# EAGLE schematic BatteryTestBoard V1 (EAGLE 8.2.2)
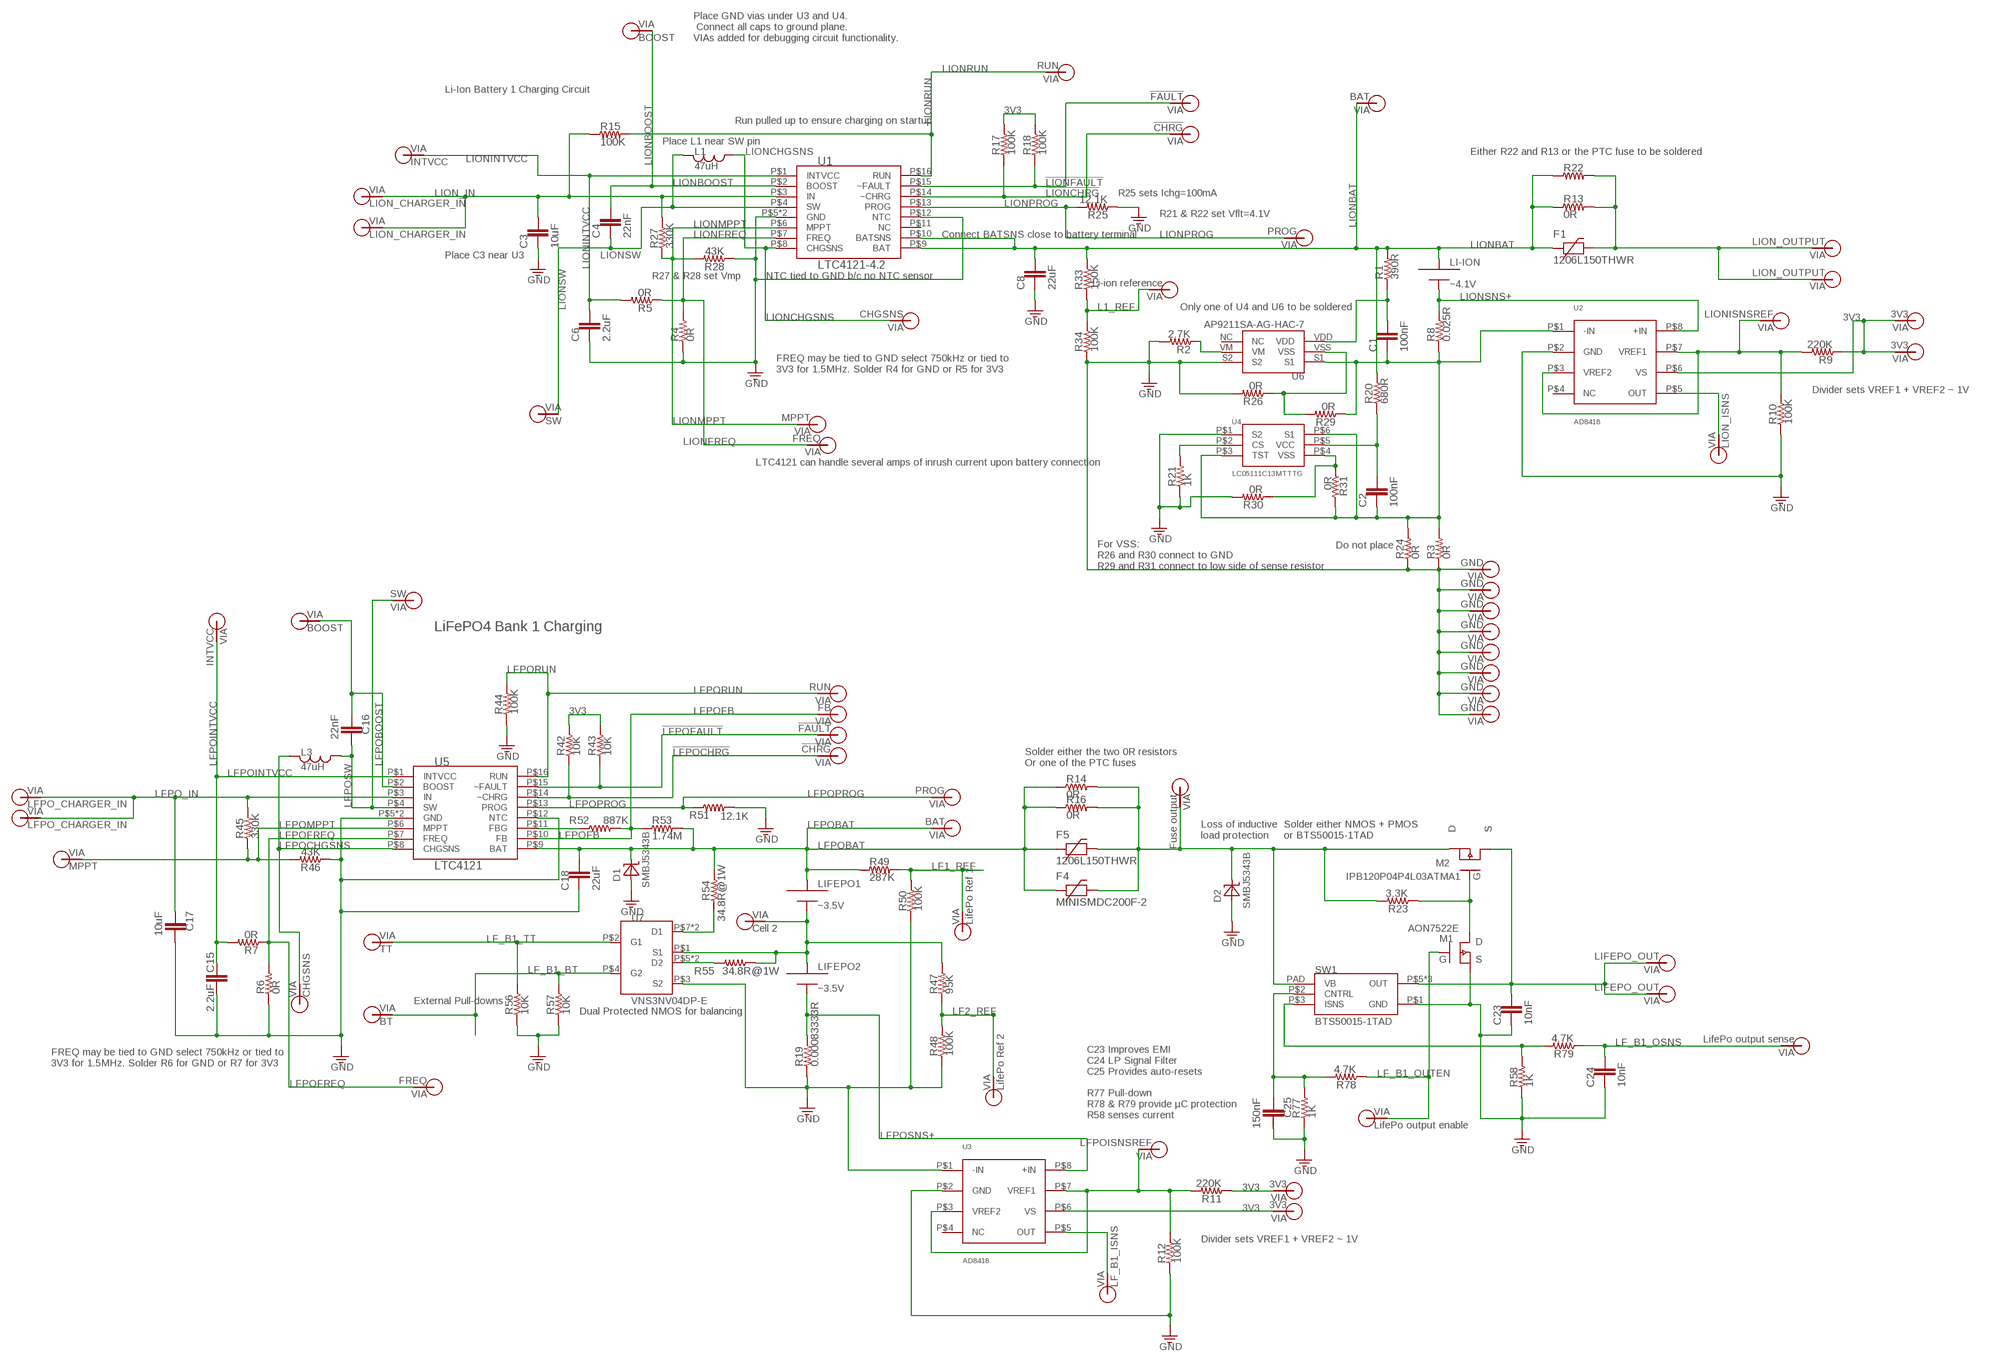
[diagram p0: schematic, sheet 1]

## Parts
C1  100nF  CAP0805  [0805]
C2  100nF  CAP0805  [0805]
C3  10uF  CAP0805  [0805]
C4  22nF  CAP0805  [0805]
C6  2.2uF  CAP0805  [0805]
C8  22uF  CAP0805  [0805]
C15  2.2uF  CAP0805  [0805]
C16  22nF  CAP0805  [0805]
C17  10uF  CAP0805  [0805]
C18  22uF  CAP0805  [0805]
C23  10nF  CAP0805  [0805]
C24  10nF  CAP0805  [0805]
C25  150nF  CAP0805  [0805]
D1  SMBJ5343B  [DO214AA]
D2  SMBJ5343B  [DO214AA]
F1  1206L150THWR  [1206]
F4  MINISMDC200F-2  [1812]
F5  1206L150THWR  [1206]
L1  47uH  IND1812  [1812]
L3  47uH  IND1812  [1812]
LI-ION  ~4.1V  LI-ION  [EQUISAT-BATTERY-VA]
LIFEPO1  ~3.5V  LIFEPO4VA  [EQUISAT-BATTERY-VA]
LIFEPO2  ~3.5V  LIFEPO4VA  [EQUISAT-BATTERY-VA]
M1  AON7522E  [DFN-3X3-8]
M2  IPB120P04P4L03ATMA1  [TO263]
R1  390R  RES0805  [0805]
R2  2.7K  RES0805  [0805]
R3  0R  RES1210  [1210]
R4  0R  RES0805  [0805]
R5  0R  RES0805  [0805]
R6  0R  RES0805  [0805]
R7  0R  RES0805  [0805]
R8  0.025R  RES1210  [1210]
R9  220K  RES0805  [0805]
R10  100K  RES0805  [0805]
R11  220K  RES0805  [0805]
R12  100K  RES0805  [0805]
R13  0R  RES1210  [1210]
R14  0R  RES1210  [1210]
R15  100K  RES0805  [0805]
R16  0R  RES1210  [1210]
R17  100K  RES0805  [0805]
R18  100K  RES0805  [0805]
R19  0.00083333R  RES1210  [1210]
R20  680R  RES0805  [0805]
R21  1K  RES0805  [0805]
R22  0R  RES1210  [1210]
R23  3.3K  RES0805  [0805]
R24  0R  RES1210  [1210]
R25  12.1K  RES0805  [0805]
R26  0R  RES0805  [0805]
R27  330K  RES0805  [0805]
R28  43K  RES0805  [0805]
R29  0R  RES0805  [0805]
R30  0R  RES0805  [0805]
R31  0R  RES0805  [0805]
R33  150K  RES0805  [0805]
R34  100K  RES0805  [0805]
R42  10K  RES0805  [0805]
R43  10K  RES0805  [0805]
R44  100K  RES0805  [0805]
R45  330K  RES0805  [0805]
R46  43K  RES0805  [0805]
R47  95K  RES0805  [0805]
R48  100K  RES0805  [0805]
R49  287K  RES0805  [0805]
R50  100K  RES0805  [0805]
R51  12.1K  RES0805  [0805]
R52  887K  RES0805  [0805]
R53  1.74M  RES0805  [0805]
R54  34.8R@1W  RES1210  [1210]
R55  34.8R@1W  RES1210  [1210]
R56  10K  RES0805  [0805]
R57  10K  RES0805  [0805]
R58  1K  RES0805  [0805]
R77  1K  RES0805  [0805]
R78  4.7K  RES0805  [0805]
R79  4.7K  RES0805  [0805]
SW1  BTS50015-1TAD  [TO-263-7-8]
U1  LTC4121-4.2  [QFN-16-PAD]
U2  AD8418  [MSOP-8]
U3  AD8418  [MSOP-8]
U4  LC05111C13MTTTG  [WDFN6]
U5  LTC4121  [QFN-16-PAD]
U6  AP9211SA-AG-HAC-7  [U-DFN2030-6]
U7  VNS3NV04DP-E  [SO-8]
V1  LION_OUTPUT  VIA-120MIL  [VIA-120MIL]
V2  Fuse output  VIA60MIL-SQ  [VIA-60MIL-SQ]
V3  GND  VIA60MIL-SQ  [VIA-60MIL-SQ]
V4  GND  VIA60MIL-SQ  [VIA-60MIL-SQ]
V5  GND  VIA60MIL-SQ  [VIA-60MIL-SQ]
V6  GND  VIA60MIL-SQ  [VIA-60MIL-SQ]
V7  GND  VIA60MIL-SQ  [VIA-60MIL-SQ]
V8  GND  VIA60MIL-SQ  [VIA-60MIL-SQ]
V9  LFPO_CHARGER_IN  VIA60MIL-SQ  [VIA-60MIL-SQ]
V10  GND  VIA60MIL-SQ  [VIA-60MIL-SQ]
V11  LFPOISNSREF  VIA60MIL-SQ  [VIA-60MIL-SQ]
V12  LIONISNSREF  VIA60MIL-SQ  [VIA-60MIL-SQ]
V13  LF_B1_ISNS  VIA60MIL-SQ  [VIA-60MIL-SQ]
V16  Cell 2  VIA60MIL-SQ  [VIA-60MIL-SQ]
V20  LifePo output enable  VIA60MIL-SQ  [VIA-60MIL-SQ]
V21  LIFEPO_OUT  VIA-120MIL  [VIA-120MIL]
V26  LIFEPO_OUT  VIA-120MIL  [VIA-120MIL]
V29  TT  VIA60MIL-SQ  [VIA-60MIL-SQ]
V31  LifePo output sense  VIA60MIL-SQ  [VIA-60MIL-SQ]
V32  BT  VIA60MIL-SQ  [VIA-60MIL-SQ]
V34  LION_CHARGER_IN  VIA60MIL-SQ  [VIA-60MIL-SQ]
V35  LION_CHARGER_IN  VIA60MIL-SQ  [VIA-60MIL-SQ]
V36  BOOST  VIA60MIL-SQ  [VIA-60MIL-SQ]
V37  LION_OUTPUT  VIA-120MIL  [VIA-120MIL]
V38  SW  VIA60MIL-SQ  [VIA-60MIL-SQ]
V39  MPPT  VIA60MIL-SQ  [VIA-60MIL-SQ]
V41  GND  VIA60MIL-SQ  [VIA-60MIL-SQ]
V43  LION_ISNS  VIA60MIL-SQ  [VIA-60MIL-SQ]
V44  Li-ion reference  VIA60MIL-SQ  [VIA-60MIL-SQ]
V46  CHGSNS  VIA60MIL-SQ  [VIA-60MIL-SQ]
V47  FREQ  VIA60MIL-SQ  [VIA-60MIL-SQ]
V48  BAT  VIA60MIL-SQ  [VIA-60MIL-SQ]
V50  PROG  VIA60MIL-SQ  [VIA-60MIL-SQ]
V51  !CHRG  VIA60MIL-SQ  [VIA-60MIL-SQ]
V52  !FAULT  VIA60MIL-SQ  [VIA-60MIL-SQ]
V53  RUN  VIA60MIL-SQ  [VIA-60MIL-SQ]
V54  BOOST  VIA60MIL-SQ  [VIA-60MIL-SQ]
V55  INTVCC  VIA60MIL-SQ  [VIA-60MIL-SQ]
V57  SW  VIA60MIL-SQ  [VIA-60MIL-SQ]
V58  LifePo Ref 1  VIA60MIL-SQ  [VIA-60MIL-SQ]
V59  LifePo Ref 2  VIA60MIL-SQ  [VIA-60MIL-SQ]
V60  MPPT  VIA60MIL-SQ  [VIA-60MIL-SQ]
V61  CHGSNS  VIA60MIL-SQ  [VIA-60MIL-SQ]
V62  FREQ  VIA60MIL-SQ  [VIA-60MIL-SQ]
V63  BAT  VIA60MIL-SQ  [VIA-60MIL-SQ]
V65  PROG  VIA60MIL-SQ  [VIA-60MIL-SQ]
V66  !CHRG  VIA60MIL-SQ  [VIA-60MIL-SQ]
V67  !FAULT  VIA60MIL-SQ  [VIA-60MIL-SQ]
V68  RUN  VIA60MIL-SQ  [VIA-60MIL-SQ]
V69  INTVCC  VIA60MIL-SQ  [VIA-60MIL-SQ]
V70  FB  VIA60MIL-SQ  [VIA-60MIL-SQ]
V71  3V3  VIA60MIL-SQ  [VIA-60MIL-SQ]
V72  3V3  VIA60MIL-SQ  [VIA-60MIL-SQ]
V73  3V3  VIA60MIL-SQ  [VIA-60MIL-SQ]
V74  3V3  VIA60MIL-SQ  [VIA-60MIL-SQ]
V75  LFPO_CHARGER_IN  VIA60MIL-SQ  [VIA-60MIL-SQ]

## Nets
3V3: R9.1 R11.1 R17.2 R18.2 R42.2 R43.2 U2.P$6(VS) U3.P$6(VS) V71.P$1 V72.P$1 V73.P$1 V74.P$1
!LFPOCHRG: R42.1 U5.P$14(~CHRG) V66.P$1
!LFPOFAULT: R43.1 U5.P$15(~FAULT) V67.P$1
!LIONCHRG: R17.1 U1.P$14(~CHRG) V51.P$1
!LIONFAULT: R18.1 U1.P$15(~FAULT) V52.P$1
FUSE_OUT: D2.C F4.P$2 F5.2 M2.2(D) R14.P$2 R16.P$2 R23.2 SW1.PAD(VB) V2.P$1
GND: C3.2 C6.2 C8.2 C15.1 C17.1 C18.2 C23.2 C24.2 C25.1 D1.A D2.A M1.P$1(S) M1.P$2(S) M1.P$3(S) R2.2 R3.P$1 R4.1 R6.1 R10.1 R12.1 R19.P$1 R21.1 R24.P$1 R25.1 R26.2 R28.1 R30.2 R34.1 R44.1 R46.1 R48.1 R50.1 R51.2 R56.1 R57.1 R58.1 R77.1 SW1.P$1(GND) U1.P$5(GND) U1.P$12(NTC) U1.P$17(GND) U2.P$2(GND) U3.P$1(-IN) U3.P$2(GND) U4.P$1(S2) U5.P$5(GND) U5.P$12(NTC) U5.P$17(GND) U6.S2 U7.P$3(S2) V3.P$1 V4.P$1 V5.P$1 V6.P$1 V7.P$1 V8.P$1 V10.P$1 V41.P$1
L1_REF: R33.1 R34.2 V44.P$1
L1_SNS: U2.P$5(OUT) V43.P$1
L1_SNS1: U3.P$5(OUT) V13.P$1
LF1_REF: R49.2 R50.2 V58.P$1
LF2_REF: R47.1 R48.2 V59.P$1
LF_B1_BT: R57.2 U7.P$4(G2) V32.P$1
LF_B1_OSNS: C24.1 R79.1 V31.P$1
LF_B1_OUTEN: M1.P$4(G) R78.1 V20.P$1
LF_B1_TT: R56.2 U7.P$2(G1) V29.P$1
LFPO_IN: C17.2 R45.2 U5.P$3(IN) V9.P$1 V75.P$1
LFPOBAT: C18.1 D1.C F4.P$1 F5.1 LIFEPO1.PLUS R14.P$1 R16.P$1 R49.1 R53.2 R54.P$2 U5.P$9(BAT) V63.P$1
LFPOBOOST: C16.2 U5.P$2(BOOST) V54.P$1
LFPOCHGSNS: L3.P$1 U5.P$8(CHGSNS) V61.P$1
LFPOFB: R52.2 R53.1 U5.P$10(FB) V70.P$1
LFPOFREQ: R6.2 R7.1 U5.P$7(FREQ) V62.P$1
LFPOINTVCC: C15.2 R7.2 U5.P$1(INTVCC) V69.P$1
LFPOMPPT: R45.1 R46.2 U5.P$6(MPPT) V60.P$1
LFPOPROG: R51.1 U5.P$13(PROG) V65.P$1
LFPORUN: R44.2 U5.P$16(RUN) V68.P$1
LFPOSNS+: LIFEPO2.MINUS R19.P$2 U3.P$8(+IN)
LFPOSW: C16.1 L3.P$2 U5.P$4(SW) V57.P$1
LIFE2: LIFEPO1.MINUS LIFEPO2.PLUS R47.2 R55.P$1 U7.P$1(S1) V16.P$1
LION_IN: C3.1 R15.1 R27.2 U1.P$3(IN) V34.P$1 V35.P$1
LIONBAT: C8.1 F1.1 LI-ION.PLUS R1.2 R13.P$1 R20.2 R22.P$1 R33.2 U1.P$9(BAT) U1.P$10(BATSNS) V48.P$1
LIONBOOST: C4.1 U1.P$2(BOOST) V36.P$1
LIONCHGSNS: L1.P$2 U1.P$8(CHGSNS) V46.P$1
LIONFREQ: R4.2 R5.1 U1.P$7(FREQ) V47.P$1
LIONINTVCC: C6.1 R5.2 U1.P$1(INTVCC) V55.P$1
LIONMPPT: R27.1 R28.2 U1.P$6(MPPT) V39.P$1
LIONPROG: R25.2 U1.P$13(PROG) V50.P$1
LIONRUN: R15.2 U1.P$16(RUN) V53.P$1
LIONSNS+: LI-ION.MINUS R8.P$2 U2.P$8(+IN)
LIONSW: C4.2 L1.P$1 U1.P$4(SW) V38.P$1
LPFOFBG: R52.1 U5.P$11(FBG)
N$1: R2.1 U6.VM
N$2: R11.2 R12.2 U3.P$3(VREF2) U3.P$7(VREF1) V11.P$1
N$3: F1.2 R13.P$2 R22.P$2 V1.P$1 V37.P$1
N$4: R26.1 R29.2 U6.VSS
N$5: C1.1 R1.1 U6.VDD
N$6: C23.1 M2.3(S) SW1.P$5(OUT) SW1.P$6(OUT) SW1.P$7(OUT) V21.P$1 V26.P$1
N$7: M1.P$5(D) M1.P$6(D) M1.P$7(D) M1.P$8(D) M1.PAD(D) M2.1(G) R23.1
N$8: C2.1 R20.1 U4.P$5(VCC)
N$9: C1.2 C2.2 R3.P$2 R8.P$1 R24.P$2 R29.1 R31.2 U2.P$1(-IN) U4.P$3(TST) U4.P$6(S1) U6.S1
N$10: R30.1 R31.1 U4.P$4(VSS)
N$11: R9.2 R10.2 U2.P$3(VREF2) U2.P$7(VREF1) V12.P$1
N$14: R21.2 U4.P$2(CS)
N$24: R54.P$1 U7.P$7(D1) U7.P$8(D1)
N$25: R55.P$2 U7.P$5(D2) U7.P$6(D2)
N$68: C25.2 R77.2 R78.2 SW1.P$2(CNTRL)
N$686: R58.2 R79.2 SW1.P$3(ISNS)
Unconnected: U1.P$11(NC) U2.P$4(NC) U3.P$4(NC) U6.NC

## Notes on the sheet
- Place GND vias under U3 and U4.
   Connect all caps to ground plane.
  VIAs added for debugging circuit functionality.
- Li-Ion Battery 1 Charging Circuit
- Run pulled up to ensure charging on startup
- Place L1 near SW pin
- Either R22 and R13 or the PTC fuse to be soldered
- R25 sets Ichg=100mA
- R21 & R22 set Vflt=4.1V
- Connect BATSNS close to battery terminal
- Place C3 near U3
- R27 & R28 set Vmp | NTC tied to GND b/c no NTC sensor
- Only one of U4 and U6 to be soldered
- FREQ may be tied to GND select 750kHz or tied to 
  3V3 for 1.5MHz. Solder R4 for GND or R5 for 3V3
- Divider sets VREF1 + VREF2 ~ 1V
- LTC4121 can handle several amps of inrush current upon battery connection
- Do not place
- For VSS:
  R26 and R30 connect to GND
  R29 and R31 connect to low side of sense resistor
- LiFePO4 Bank 1 Charging
- Solder either the two 0R resistors
  Or one of the PTC fuses
- Loss of inductive
  load protection
- Solder either NMOS + PMOS
  or BTS50015-1TAD
- AON7522E
- External Pull-downs
- Dual Protected NMOS for balancing
- FREQ may be tied to GND select 750kHz or tied to 
  3V3 for 1.5MHz. Solder R6 for GND or R7 for 3V3
- C23 Improves EMI
  C24 LP Signal Filter
  C25 Provides auto-resets
  
  R77 Pull-down
  R78 & R79 provide µC protection
  R58 senses current
- Divider sets VREF1 + VREF2 ~ 1V

## Library data of the parts
C1-C4 C6 C8 C15-C18 C23-C25 = BrownSpaceEngineering:CAP: Capacitor
D1 D2 = BattBoard:SMBJ5343B
F1 F5 = BattBoard:1206L150THWR
F4 = BattBoard:MINISMDC200F-2
L1 L3 = BrownSpaceEngineering:IND
LI-ION = BrownSpaceEngineering:LI-ION
LIFEPO1 LIFEPO2 = BrownSpaceEngineering:LIFEPO4
M1 = BrownSpaceEngineering:AON7522E
M2 = BattBoard:IPB120P04P4L03ATMA1
R1-R31 R33 R34 R42-R58 R77-R79 = BrownSpaceEngineering:RES
SW1 = BrownSpaceEngineering:BTS50015-1TAD
U1 = BrownSpaceEngineering:LTC4121-4.2
U2 U3 = BattBoard:AD8418
U4 = BattBoard:LC05111C13MTTTG
U5 = BrownSpaceEngineering:LTC4121
U6 = BattBoard:AP9211SA-AG-HAC-7
U7 = BrownSpaceEngineering:VNS3NV04DP-E
V1-V13 V16 V20 V21 V26 V29 V31 V32 V34-V39 V41 V43 V44 V46-V48 V50-V55 V57-V63 V65-V75 = BrownSpaceEngineering:VIA

## Net classes
0 default: width 0.203 mm